# Altium project Bedinelement_GuidingSystem.PrjPCB
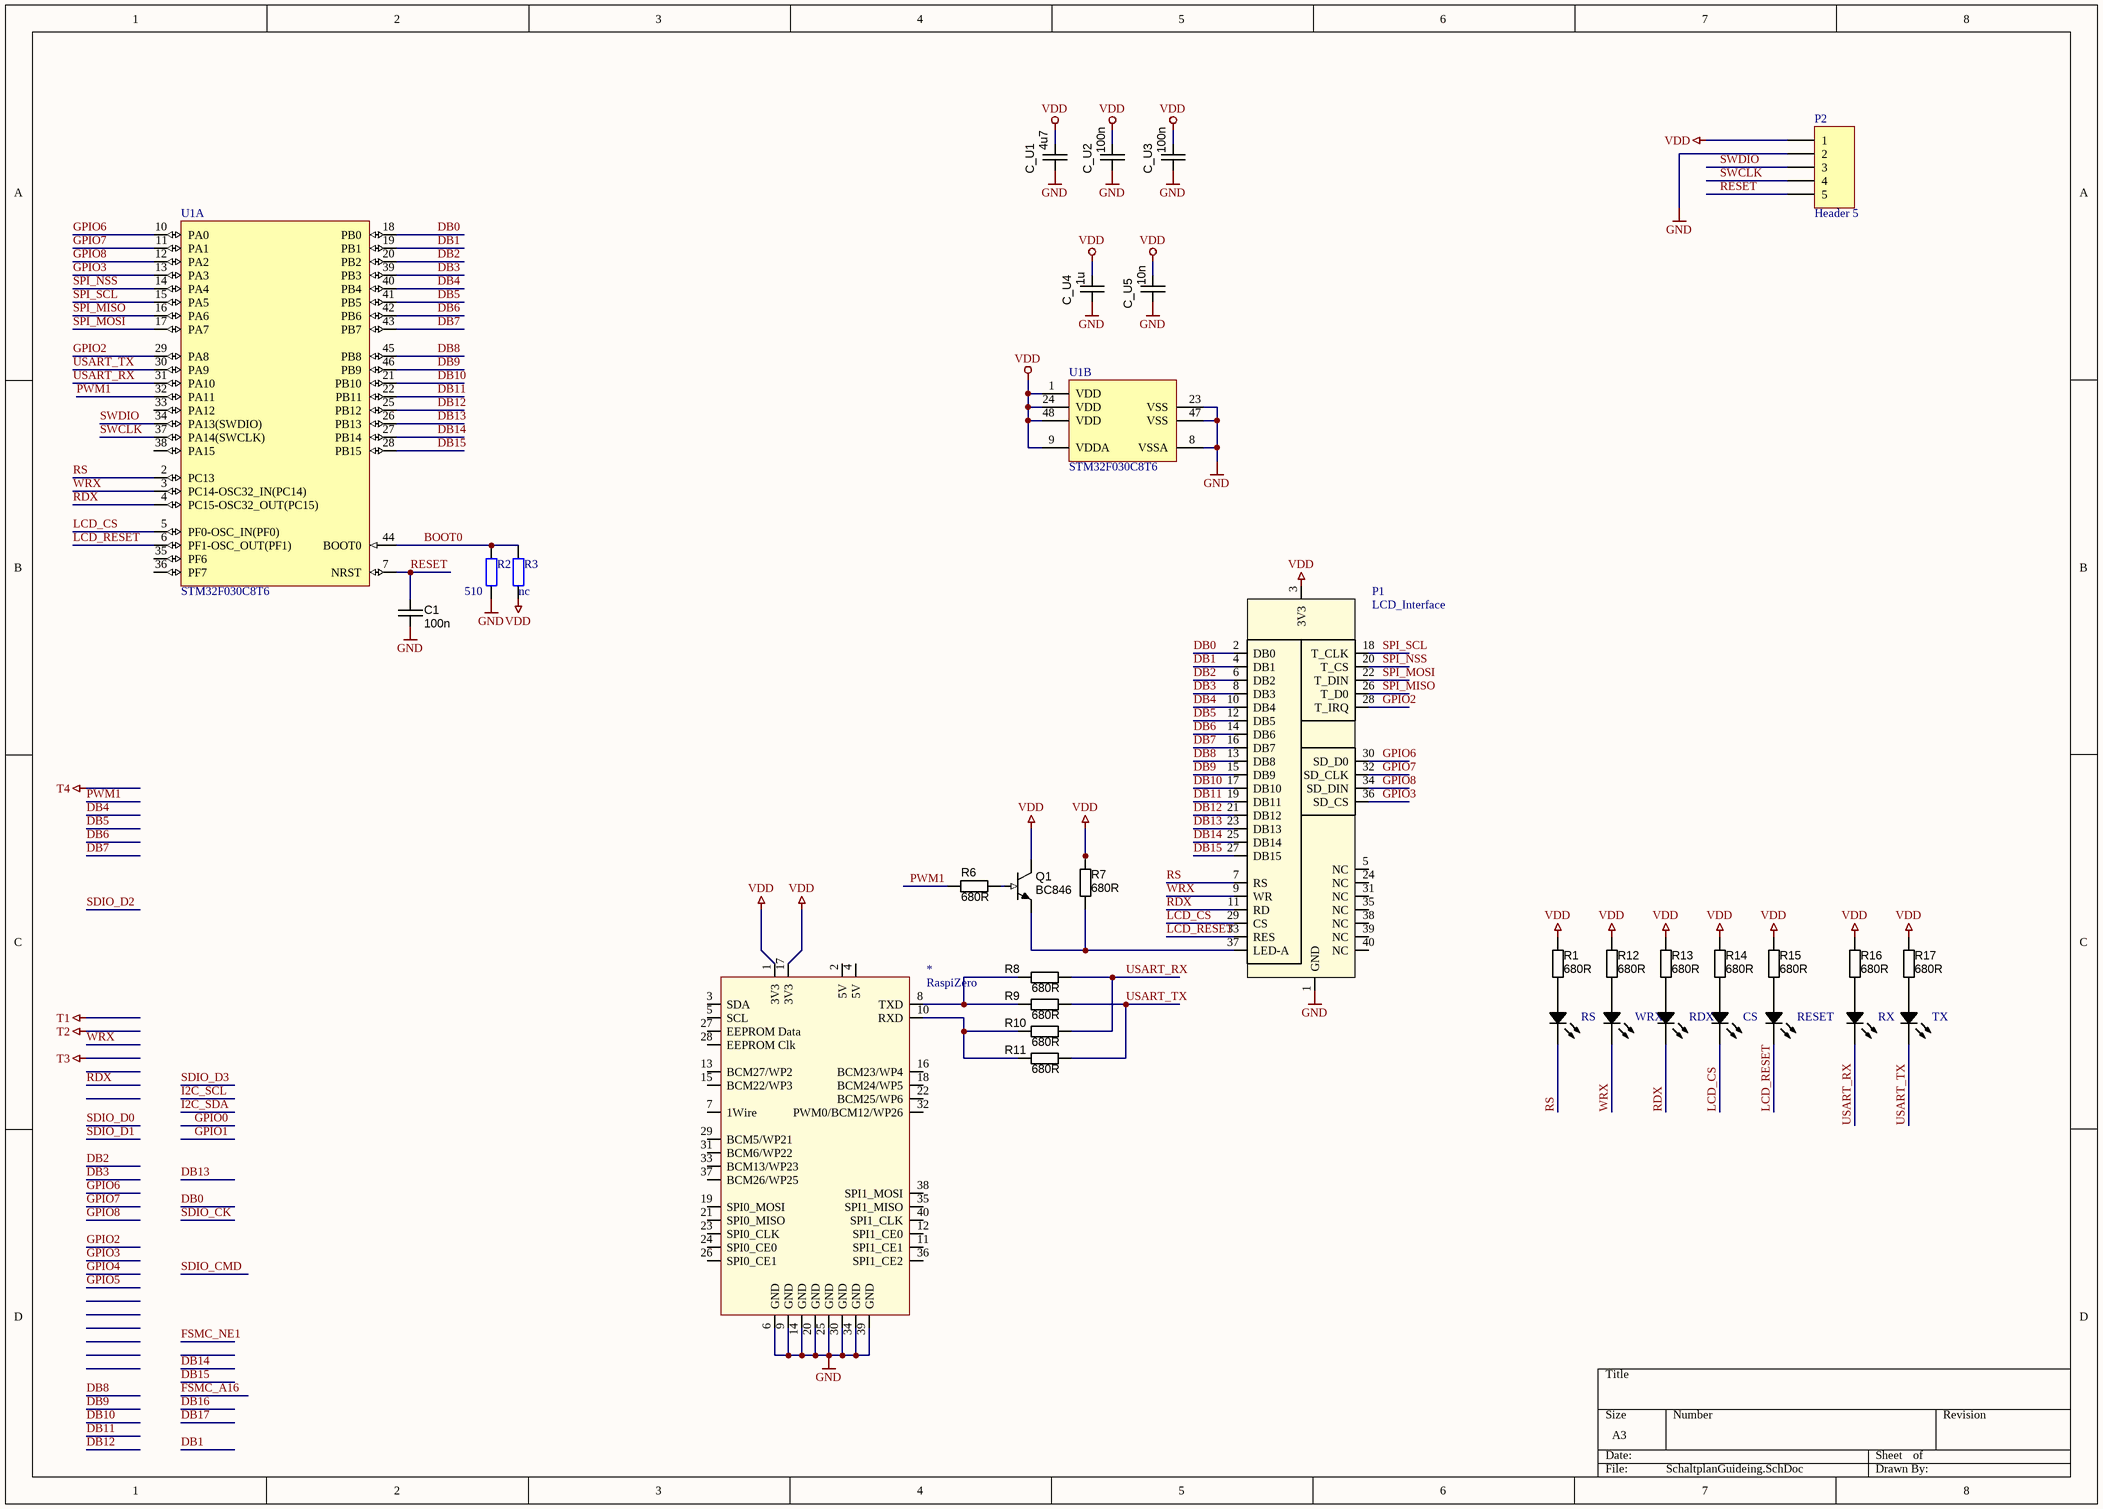
[diagram p0: SchaltplanGuideing.SchDoc]
1 sheet, 33 parts. Net scope: global (net labels, ports and power ports of the same name join across sheets).
Board file: PCBGuiding.PcbDoc

## Sheet SchaltplanGuideing.SchDoc
size A3

### Parts
*  RaspiZero  [PIZero]
C1  value 100n  [CAPC2012N_0805]  (hidden comment: approved sub OK)
C_U1  value 4u7  [CAPC2012N_0805]  (hidden comment: approved sub OK)
C_U2  value 100n  [CAPC2012N_0805]  (hidden comment: approved sub OK)
C_U3  value 100n  [CAPC2012N_0805]  (hidden comment: approved sub OK)
C_U4  value 1u  [CAPC2012N_0805]  (hidden comment: approved sub OK)
C_U5  value 10n  [CAPC2012N_0805]  (hidden comment: approved sub OK)
CS  (no value)  [LED_0805]
P1  LCD_Interface  [40Pol]
P2  Header 5  [HDR1X5]
Q1  BC846  [SOT23-3]
R1  value 680R  [0608_RES]  (hidden comment: Thick Film)
R2  value 510  [RESC2012N_0805]
R3  value nc  [RESC2012N_0805]
R6  value 680R  [0608_RES]  (hidden comment: Thick Film)
R7  value 680R  [0608_RES]  (hidden comment: Thick Film)
R8  value 680R  [0608_RES]  (hidden comment: Thick Film)
R9  value 680R  [0608_RES]  (hidden comment: Thick Film)
R10  value 680R  [0608_RES]  (hidden comment: Thick Film)
R11  value 680R  [0608_RES]  (hidden comment: Thick Film)
R12  value 680R  [0608_RES]  (hidden comment: Thick Film)
R13  value 680R  [0608_RES]  (hidden comment: Thick Film)
R14  value 680R  [0608_RES]  (hidden comment: Thick Film)
R15  value 680R  [0608_RES]  (hidden comment: Thick Film)
R16  value 680R  [0608_RES]  (hidden comment: Thick Film)
R17  value 680R  [0608_RES]  (hidden comment: Thick Film)
RDX  (no value)  [LED_0805]
RESET  (no value)  [LED_0805]
RS  (no value)  [LED_0805]
RX  (no value)  [LED_0805]
TX  (no value)  [LED_0805]
U1  STM32F030C8T6  [LQFP48_M]  (parts A,B of 2)
WRX  (no value)  [LED_0805]

### Nets
GND: *.6(GND) *.9(GND) *.14(GND) *.20(GND) *.25(GND) *.30(GND) *.34(GND) *.39(GND) C1.1 C_U1.2 C_U2.2 C_U3.2 C_U4.2 C_U5.2 P1.1(GND) P2.2 R2.1 U1.8(VSSA) U1.23(VSS) U1.47(VSS)
VDD: *.1(3V3) *.17(3V3) C_U1.1 C_U2.1 C_U3.1 C_U4.1 C_U5.1 P1.3(3V3) P2.1 Q1.3(C) R1.1 R3.1 R7.1 R12.1 R13.1 R14.1 R15.1 R16.1 R17.1 U1.1(VDD) U1.9(VDDA) U1.24(VDD) U1.48(VDD)
BOOT0: R2.2 R3.2 U1.44(BOOT0)
DB0: P1.2(DB0) U1.18(PB0)
DB1: P1.4(DB1) U1.19(PB1)
DB2: P1.6(DB2) U1.20(PB2)
DB3: P1.8(DB3) U1.39(PB3)
DB4: P1.10(DB4) U1.40(PB4)
DB5: P1.12(DB5) U1.41(PB5)
DB6: P1.14(DB6) U1.42(PB6)
DB7: P1.16(DB7) U1.43(PB7)
DB8: P1.13(DB8) U1.45(PB8)
DB9: P1.15(DB9) U1.46(PB9)
DB10: P1.17(DB10) U1.21(PB10)
DB11: P1.19(DB11) U1.22(PB11)
DB12: P1.21(DB12) U1.25(PB12)
DB13: P1.23(DB13) U1.26(PB13)
DB14: P1.25(DB14) U1.27(PB14)
DB15: P1.27(DB15) U1.28(PB15)
GPIO2: P1.28(T_IRQ) U1.29(PA8)
GPIO3: P1.36(SD_CS) U1.13(PA3)
GPIO6: P1.30(SD_D0) U1.10(PA0)
GPIO7: P1.32(SD_CLK) U1.11(PA1)
GPIO8: P1.34(SD_DIN) U1.12(PA2)
LCD_CS: CS.2 P1.29(CS) U1.5(PF0-OSC_IN(PF0))
LCD_RESET: P1.33(RES) RESET.2 U1.6(PF1-OSC_OUT(PF1))
PWM1: R6.2 U1.32(PA11)
RDX: P1.11(RD) RDX.2 U1.4(PC15-OSC32_OUT(PC15))
RESET: C1.2 P2.5 U1.7(NRST)
RS: P1.7(RS) RS.2 U1.2(PC13)
SPI_MISO: P1.26(T_D0) U1.16(PA6)
SPI_MOSI: P1.22(T_DIN) U1.17(PA7)
SPI_NSS: P1.20(T_CS) U1.14(PA4)
SPI_SCL: P1.18(T_CLK) U1.15(PA5)
SWCLK: P2.4 U1.37(PA14(SWCLK))
SWDIO: P2.3 U1.34(PA13(SWDIO))
USART_RX: R8.1 R10.1 RX.2 U1.31(PA10)
USART_TX: R9.1 R11.1 TX.2 U1.30(PA9)
WRX: P1.9(WR) U1.3(PC14-OSC32_IN(PC14)) WRX.2
Net*_8: *.8(TXD) R8.2 R9.2
Net*_10: *.10(RXD) R10.2 R11.2
NetCS_1: CS.1 R14.2
NetP1_37: P1.37(LED-A) Q1.2(E) R7.2
NetQ1_1: Q1.1(B) R6.1
NetR1_2: R1.2 RS.1
NetR12_2: R12.2 WRX.1
NetR13_2: R13.2 RDX.1
NetR15_2: R15.2 RESET.1
NetR16_2: R16.2 RX.1
NetR17_2: R17.2 TX.1

Not connected (* = marked no-connect by the designer): * 2(5V) 3(SDA) 4(5V) 5(SCL) 7(1Wire) 11(SPI1_CE1) 12(SPI1_CE0) 13(BCM27/WP2) 15(BCM22/WP3) 16(BCM23/WP4) 18(BCM24/WP5) 19(SPI0_MOSI) 21(SPI0_MISO) 22(BCM25/WP6) 23(SPI0_CLK) 24(SPI0_CE0) 26(SPI0_CE1) 27(EEPROM_Data) 28(EEPROM_Clk) 29(BCM5/WP21) 31(BCM6/WP22) 32(PWM0/BCM12/WP26) 33(BCM13/WP23) 35(SPI1_MISO) 36(SPI1_CE2) 37(BCM26/WP25) 38(SPI1_MOSI) 40(SPI1_CLK); P1 5(NC) 24(NC) 31(NC) 35(NC) 38(NC) 39(NC) 40(NC); U1 33(PA12) 35(PF6) 36(PF7) 38(PA15)

### Library data of the parts
C1 = CAPC_1u_0603_X7R_16V_10%: Capacitor SMD Cer 1uF 10% 16V X7R 0603; Manufacturer 1: TDK Corporation; Manufacturer Part Number 1: C1608X7R1C105K; Ratings: 16V; X7R; Material: ceramic; SCDType: spec; Package / Case: 0603 (1608 metric); Tolerance: ±10%; Supplier 1: Digi-Key; Supplier Part Number 1: 445-1604-1-ND; ComponentLink1URL: http://product.tdk.com/capacitor/mlcc/en/documents/mlcc_commercial_general_en.pdf; ComponentLink1Description: http://product.tdk.com/capacitor/mlcc/en/documents/mlcc_commercial_general_en.pdf
C_U1 = CAPC_1u_0603_X7R_16V_10%: Capacitor SMD Cer 4,7uF 10% 16V X7R 0603; Manufacturer 1: TDK Corporation; Manufacturer Part Number 1: C1608X7R1C105K; Ratings: 16V; X7R; SCDType: spec; Package / Case: 0603 (1608 metric); Tolerance: ±10%; Material: ceramic; Supplier 1: Digi-Key; Supplier Part Number 1: 445-1604-1-ND; ComponentLink1URL: http://product.tdk.com/capacitor/mlcc/en/documents/mlcc_commercial_general_en.pdf; ComponentLink1Description: http://product.tdk.com/capacitor/mlcc/en/documents/mlcc_commercial_general_en.pdf
C_U2 = CAPC_1u_0603_X7R_16V_10%: Capacitor SMD Cer 100nF 10% 16V X7R 0603; Manufacturer 1: TDK Corporation; Manufacturer Part Number 1: C1608X7R1C105K; Ratings: 16V; X7R; SCDType: spec; Package / Case: 0603 (1608 metric); Tolerance: ±10%; Material: ceramic; Supplier 1: Digi-Key; Supplier Part Number 1: 445-1604-1-ND; ComponentLink1URL: http://product.tdk.com/capacitor/mlcc/en/documents/mlcc_commercial_general_en.pdf; ComponentLink1Description: http://product.tdk.com/capacitor/mlcc/en/documents/mlcc_commercial_general_en.pdf
C_U3 C_U4 = CAPC_1u_0603_X7R_16V_10%: Capacitor SMD Cer 1uF 10% 16V X7R 0603; Manufacturer 1: TDK Corporation; Manufacturer Part Number 1: C1608X7R1C105K; Ratings: 16V; X7R; SCDType: spec; Package / Case: 0603 (1608 metric); Tolerance: ±10%; Material: ceramic; Supplier 1: Digi-Key; Supplier Part Number 1: 445-1604-1-ND; ComponentLink1URL: http://product.tdk.com/capacitor/mlcc/en/documents/mlcc_commercial_general_en.pdf; ComponentLink1Description: http://product.tdk.com/capacitor/mlcc/en/documents/mlcc_commercial_general_en.pdf
C_U5 = CAPC_1u_0603_X7R_16V_10%: Capacitor SMD Cer 10nF 10% 16V X7R 0603; Manufacturer 1: TDK Corporation; Manufacturer Part Number 1: C1608X7R1C105K; Ratings: 16V; X7R; SCDType: spec; Package / Case: 0603 (1608 metric); Tolerance: ±10%; Material: ceramic; Supplier 1: Digi-Key; Supplier Part Number 1: 445-1604-1-ND; ComponentLink1URL: http://product.tdk.com/capacitor/mlcc/en/documents/mlcc_commercial_general_en.pdf; ComponentLink1Description: http://product.tdk.com/capacitor/mlcc/en/documents/mlcc_commercial_general_en.pdf
CS RDX RESET RS RX TX WRX = LED_0805
P2 = Header 5: Header, 5-Pin; LatestRevisionDate: 17-Jul-2002; LatestRevisionNote: Re-released for DXP Platform.; Publisher: Altium Limited
Q1 = NPN_MMBT2222A: Transistor SMD NPN 250mW SOT23-3; Value: BC846
R1 R6-R17 = RES_0R_0603: Resistor SMD chip 0.0 Ohm 0.1W 0603; Manufacturer 1: Vishay/Dale; Manufacturer Part Number 1: CRCW06030000Z0EA; Tolerance: ±5%; Ratings: 1/10W; SCDType: spec; Package / Case: 0603 (1608metric); Supplier 1: Digi-Key; Supplier Part Number 1: 541-0.0GCT-ND; ComponentLink1URL: http://www.vishay.com/doc?20035; ComponentLink1Description: http://www.vishay.com/doc?20035; Supplier 2: Digi-Key; Supplier Part Number 2: P0.0GTR-ND; Manufacturer 2: Panasonic Electronic Components; Manufacturer Part Number 2: ERJ-3GEY0R00V; RoHS 2: RoHS Compliant; ComponentLink2URL: http://industrial.panasonic.com/www-cgi/jvcr13pz.cgi?E+PZ+3+AOA0001+ERJ3GEY0R00V+7+WW; ComponentLink2Description: http://industrial.panasonic.com/www-cgi/jvcr13pz.cgi?E+PZ+3+AOA0001+ERJ3GEY0R00V+7+WW; Supplier 3: Digi-Key; Supplier Part Number 3: 311-0.0LECT-ND; Manufacturer 3: Yageo; Manufacturer Part Number 3: AC0603JR-070RL; RoHS 3: RoHS Compliant; ComponentLink3URL: http://www.yageo.com/documents/recent/PYu-AC_51_RoHS_L_2.pdf; ComponentLink3Description: http://www.yageo.com/documents/recent/PYu-AC_51_RoHS_L_2.pdf
R2 R3 = Res2: Resistor; Published: 8-Jun-2000; LatestRevisionDate: 17-Jul-2002; LatestRevisionNote: Re-released for DXP Platform.; PackageReference: AXIAL-0.4; Publisher: Altium Limited; PackageDescription: Axial Device, Thru-Hole; 2 Leads; 0.4 in Pin Spacing
U1 = STM32F030C8T6: ARM Cortex-M0 32-bit MCU, 64 KB Flash, 8 KB Internal RAM, 39 I/Os, 48-pin LQFP, -40 to 85 degC, Tray; Operating Frequency(F) (Processor speed) (MHz): 48; Supply Voltage(Vcc) min (V): 2.4; FLASH Size (Prog) (kB): 64; I/Os (High Current): 39; Internal RAM Size (kB): 8; Core: ARM Cortex-M0; ComponentLink2Description: Datasheet; DatasheetVersion: Rev. 1; PackageDescription: 48-Pin Low Profile Quad Flat Package, 7 x 7 mm Body, 0.5 mm Pitch; ComponentLink3URL: http://www.st.com/st-web-ui/static/active/en/resource/technical/document/datasheet/DM00058181.pdf; ComponentLink3Description: Package Specification; ComponentLink1URL: http://www.st.com/web/en/home.html; ComponentLink1Description: Manufacturer URL; ComponentLink2URL: http://www.st.com/st-web-ui/static/active/en/resource/technical/document/datasheet/DM00088500.pdf; Packing: Tray; PackageVersion: Rev. 6, 06/2013; Mounting Technology: Surface Mount; PartNumber: STM32F030C8T6; PackageReference: LQFP48